# Altium project Preliminary.PrjPcb
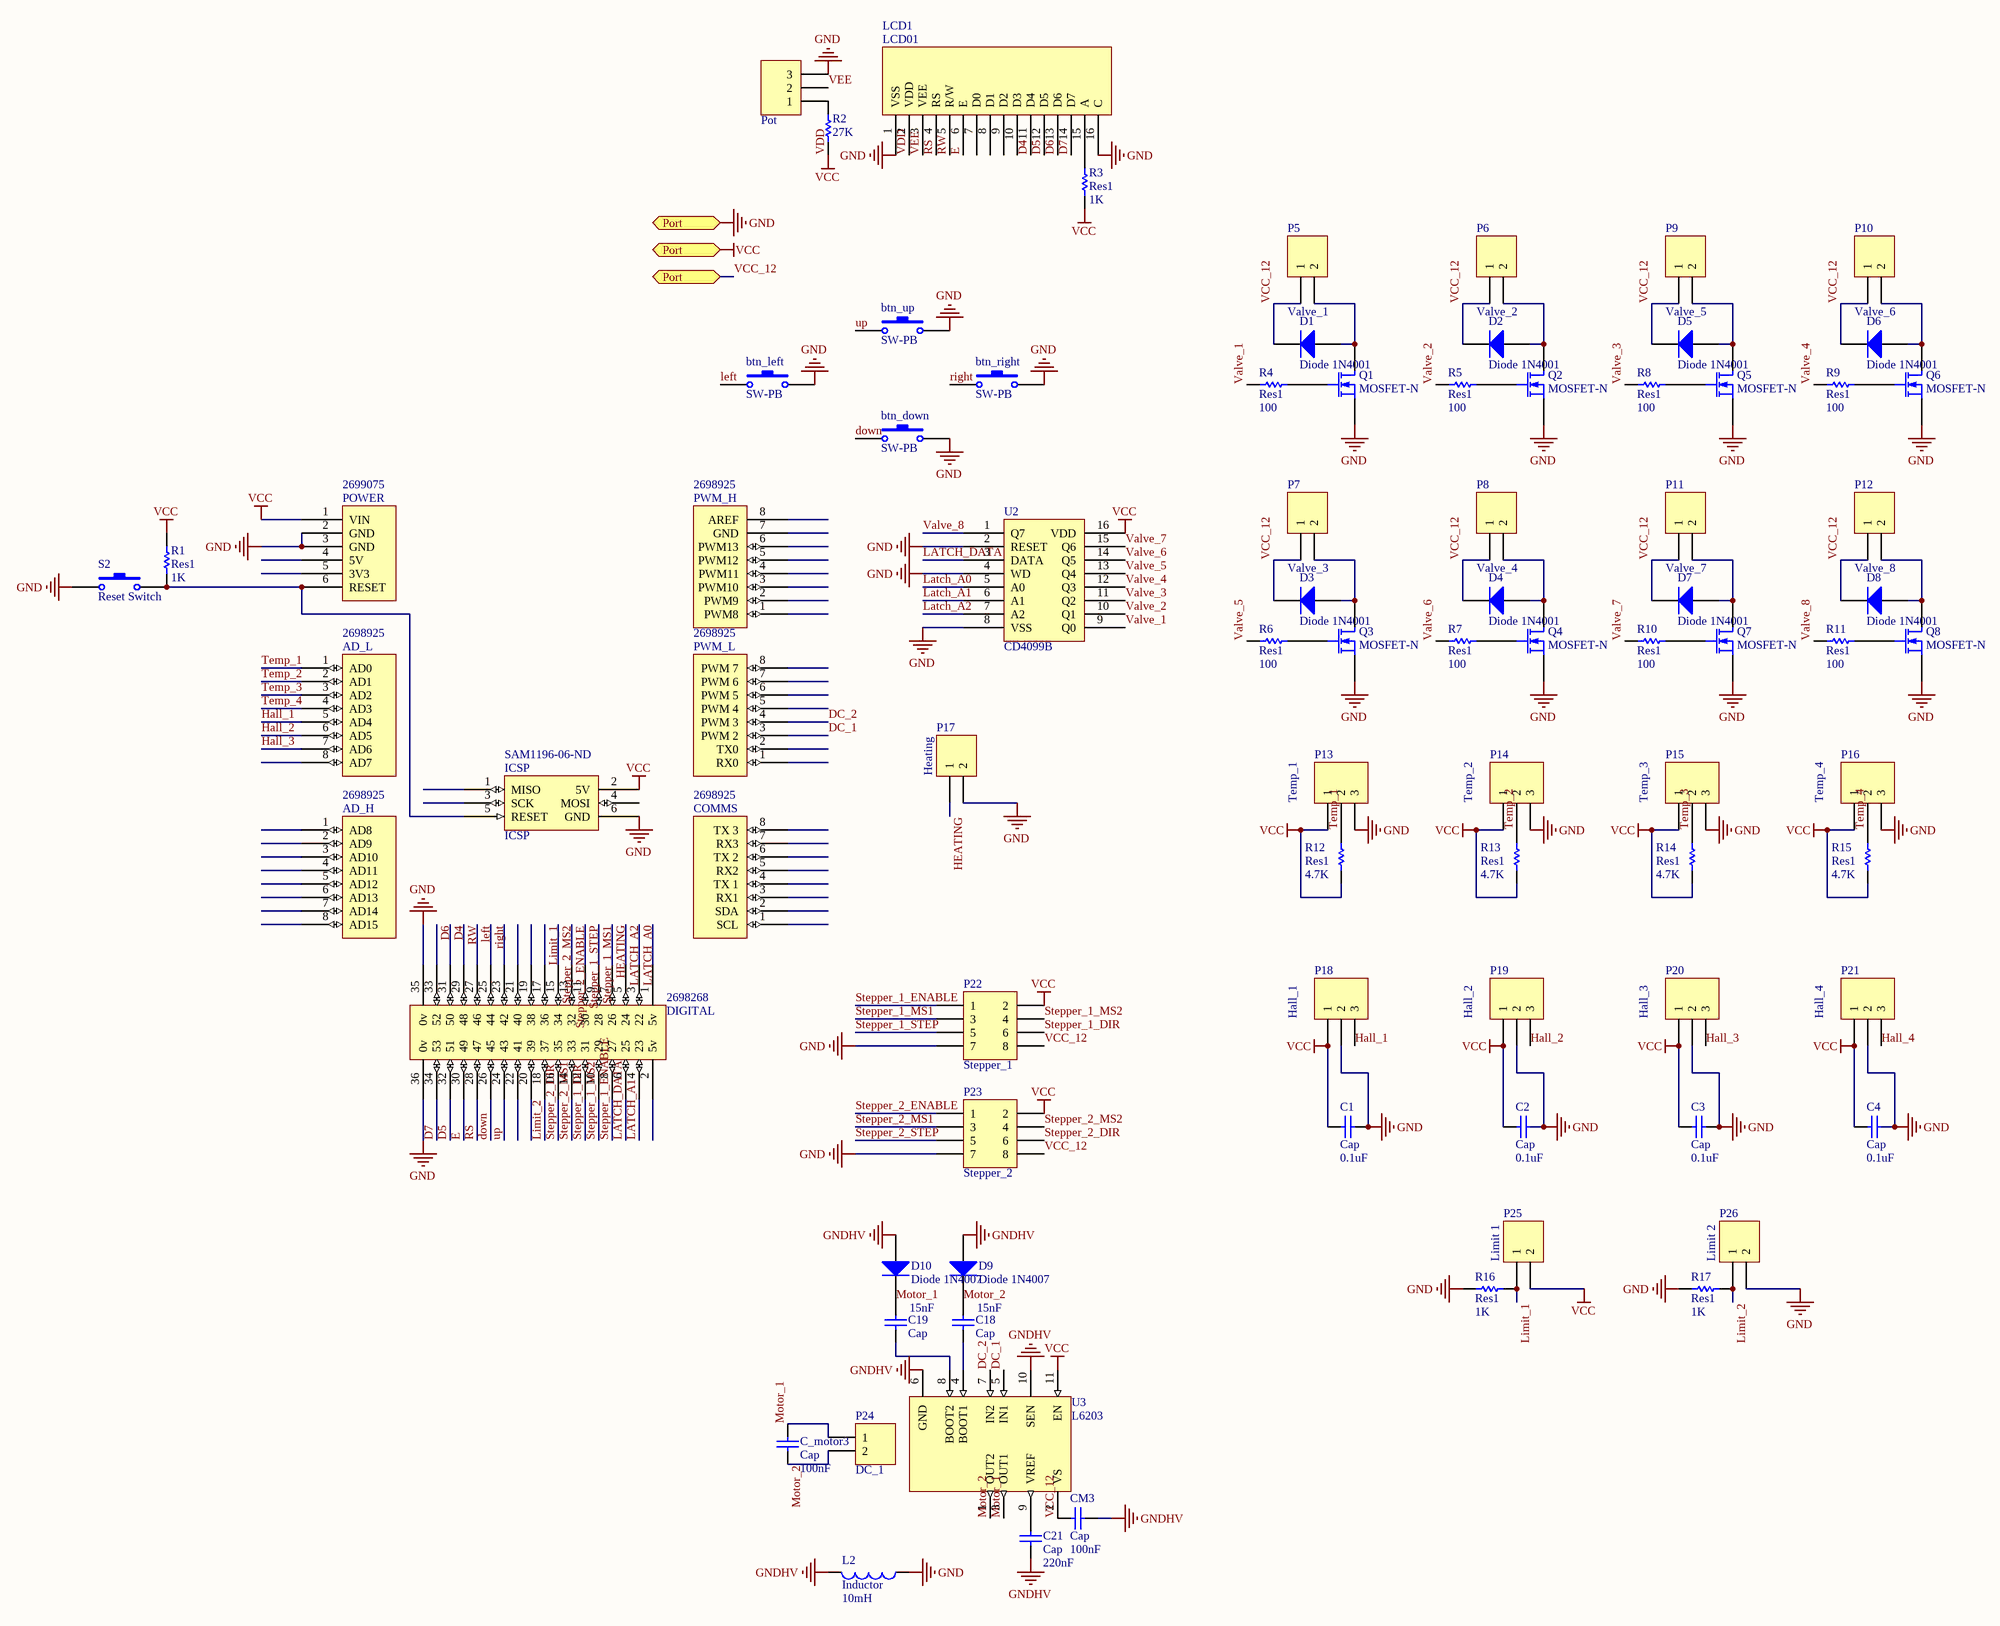
[diagram p0: MainBoard.SchDoc]
2 sheets, 90 parts. Net scope: flat (ports and power ports of the same name join across sheets).
Board file: MainBoard.PcbDoc
Sheets:
  MainBoard.SchDoc
  Heating.SchDoc

## Sheet MainBoard.SchDoc
size 762 x 482 mm

### Parts
AD_H  Supplier Part Number 4: 2698925  [Header 8x1 8.5mm]  (hidden comment: AD_H)
AD_L  Supplier Part Number 5: 2698925  [Header 8x1 8.5mm]  (hidden comment: AD_L)
btn_down  SW-PB  [swblue]
btn_left  SW-PB  [swblue]
btn_right  SW-PB  [swblue]
btn_up  SW-PB  [swblue]
C1  Cap  value 0.1uF  [RAD-0.3]
C2  Cap  value 0.1uF  [RAD-0.3]
C3  Cap  value 0.1uF  [RAD-0.3]
C4  Cap  value 0.1uF  [RAD-0.3]
C18  Cap  value 15nF  [VP32-3.2]
C19  Cap  value 15nF  [VP32-3.2]
C21  Cap  value 220nF  [c224]
C_motor3  Cap  value 100nF  [VP32-3.2]
CM3  Cap  value 100nF  [VP32-3.2]
COMMS  Supplier Part Number 4: 2698925  [Header 8x1 8.5mm]  (hidden comment: Communication)
D1  Diode 1N4001  [DO-41]
D2  Diode 1N4001  [DO-41]
D3  Diode 1N4001  [DO-41]
D4  Diode 1N4001  [DO-41]
D5  Diode 1N4001  [DO-41]
D6  Diode 1N4001  [DO-41]
D7  Diode 1N4001  [DO-41]
D8  Diode 1N4001  [DO-41]
D9  Diode 1N4007  [DO-41]
D10  Diode 1N4007  [DO-41]
DIGITAL  Supplier Part Number 5: 2698268  [HEADER 36X 8MM]  (hidden comment: IO_36)
ICSP  ICSP  Supplier Part Number 5: SAM1196-06-ND  [ICSP]
L2  Inductor  value 10mH  [0402-A]
LCD1  lcd  [lcd_woborder]  (value not drawn)
P5  Valve_1  [HDR1X2]
P6  Valve_2  [HDR1X2]
P7  Valve_3  [HDR1X2]
P8  Valve_4  [HDR1X2]
P9  Valve_5  [HDR1X2]
P10  Valve_6  [HDR1X2]
P11  Valve_7  [HDR1X2]
P12  Valve_8  [HDR1X2]
P13  Temp_1  [HDR1X3]
P14  Temp_2  [HDR1X3]
P15  Temp_3  [HDR1X3]
P16  Temp_4  [HDR1X3]
P17  Heating  [HDR1X2]
P18  Hall_1  [HDR1X3]
P19  Hall_2  [HDR1X3]
P20  Hall_3  [HDR1X3]
P21  Hall_4  [HDR1X3]
P22  Stepper_1  [HDR2X4]
P23  Stepper_2  [HDR2X4]
P24  DC_1  [1X2]
P25  Limit 1  [HDR1X2]
P26  Limit 2  [HDR1X2]
Pot  Pot  [HDR1X3]
POWER  Supplier Part Number 2: 2699075  [Header 6x1 8.5mm]  (hidden comment: POWER)
PWM_H  Supplier Part Number 4: 2698925  [Header 8x1 8.5mm]  (hidden comment: PWM_H)
PWM_L  Supplier Part Number 4: 2698925  [Header 8x1 8.5mm]  (hidden comment: PWM_L)
Q1  MOSFET-N  [E3]
Q2  MOSFET-N  [E3]
Q3  MOSFET-N  [E3]
Q4  MOSFET-N  [E3]
Q5  MOSFET-N  [E3]
Q6  MOSFET-N  [E3]
Q7  MOSFET-N  [E3]
Q8  MOSFET-N  [E3]
R1  Res1  value 1K  [AXIAL-0.3]
R2  value 27K  [AXIAL-0.3]  (hidden comment: Res1)
R3  Res1  value 1K  [AXIAL-0.3]
R4  Res1  value 100  [AXIAL-0.3]
R5  Res1  value 100  [AXIAL-0.3]
R6  Res1  value 100  [AXIAL-0.3]
R7  Res1  value 100  [AXIAL-0.3]
R8  Res1  value 100  [AXIAL-0.3]
R9  Res1  value 100  [AXIAL-0.3]
R10  Res1  value 100  [AXIAL-0.3]
R11  Res1  value 100  [AXIAL-0.3]
R12  Res1  value 4.7K  [AXIAL-0.3]
R13  Res1  value 4.7K  [AXIAL-0.3]
R14  Res1  value 4.7K  [AXIAL-0.3]
R15  Res1  value 4.7K  [AXIAL-0.3]
R16  Res1  value 1K  [AXIAL-0.3]
R17  Res1  value 1K  [AXIAL-0.3]
S2  Reset Switch  [SPST-2]
U2  CD4099B  [CB4099B]
U3  L6203  [DRVCON]

### Ports
Port

### Nets
GNDHV: C21.2 CM3.2 D9.1(A) D10.1(A) L2.2 U3.6(GND) U3.10(SEN)
VCC_12: btn_down.2 btn_left.2 btn_right.2 btn_up.2 C1.1 C1.2 C2.1 C2.2 C3.1 C3.2 C4.1 C4.2 CM3.1 D1.2(K) D2.2(K) D3.2(K) D4.2(K) D5.2(K) D6.2(K) D7.2(K) D8.2(K) DIGITAL.35(0v) DIGITAL.36(0v) ICSP.2(5V) ICSP.6(GND) L2.1 LCD1.1(VSS) LCD1.2(VDD) LCD1.16(C) P5.1 P6.1 P7.1 P8.1 P9.1 P10.1 P11.1 P12.1 P13.1 P13.3 P14.1 P14.3 P15.1 P15.3 P16.1 P16.3 P17.2 P18.1 P18.2 P19.1 P19.2 P20.1 P20.2 P21.1 P21.2 P22.2 P22.7 P22.8 P23.2 P23.7 P23.8 P25.2 P26.2 Pot.3 POWER.1(VIN) POWER.2(GND) POWER.3(GND) Q1.3(S) Q2.3(S) Q3.3(S) Q4.3(S) Q5.3(S) Q6.3(S) Q7.3(S) Q8.3(S) R1.1 R2.2 R3.1 R12.1 R13.1 R14.2 R15.1 R16.2 R17.2 S2.1 U2.2(RESET) U2.4(WD) U2.8(VSS) U2.16(VDD) U3.2(VS) U3.11(EN) ; port Port  [also labelled GND, VCC, VDD]
D4: DIGITAL.31(50) LCD1.11(D4)
D5: DIGITAL.32(51) LCD1.12(D5)
D6: DIGITAL.33(52) LCD1.13(D6)
D7: DIGITAL.34(53) LCD1.14(D7)
DC_1: PWM_L.3(PWM_2) U3.5(IN1)
DC_2: PWM_L.4(PWM_3) U3.7(IN2)
down: btn_down.1 DIGITAL.26(45)
E: DIGITAL.30(49) LCD1.6(E)
Hall_1: AD_L.5(AD4) P18.3
Hall_2: AD_L.6(AD5) P19.3
Hall_3: AD_L.7(AD6) P20.3
Hall_4: P21.3
HEATING: DIGITAL.7(26) P17.1
Latch_A0: DIGITAL.3(22) U2.5(A0)
Latch_A1: DIGITAL.4(23) U2.6(A1)
Latch_A2: DIGITAL.5(24) U2.7(A2)
LATCH_DATA: DIGITAL.6(25) U2.3(DATA)
left: btn_left.1 DIGITAL.27(46)
Limit_1: DIGITAL.17(36) P25.1 R16.1
Limit_2: DIGITAL.18(37) P26.1 R17.1
Motor_1: C19.2 C_motor3.2 D10.2(K) P24.1 U3.3(OUT1)
Motor_2: C18.2 C_motor3.1 D9.2(K) P24.2 U3.1(OUT2)
right: btn_right.1 DIGITAL.25(44)
RS: DIGITAL.28(47) LCD1.4(RS)
RW: DIGITAL.29(48) LCD1.5(R/W)
Stepper_1_DIR: DIGITAL.12(31) P22.6
Stepper_1_ENABLE: DIGITAL.8(27) P22.1
Stepper_1_MS1: DIGITAL.9(28) P22.3
Stepper_1_MS2: DIGITAL.10(29) P22.4
Stepper_1_STEP: DIGITAL.11(30) P22.5
Stepper_2_DIR: DIGITAL.16(35) P23.6
Stepper_2_ENABLE: DIGITAL.13(32) P23.1
Stepper_2_MS1: DIGITAL.14(33) P23.3
Stepper_2_MS2: DIGITAL.15(34) P23.4
Stepper_2_STEP: P23.5
Temp_1: AD_L.1(AD0) P13.2 R12.2
Temp_2: AD_L.2(AD1) P14.2 R13.2
Temp_3: AD_L.3(AD2) P15.2 R14.1
Temp_4: AD_L.4(AD3) P16.2 R15.2
up: btn_up.1 DIGITAL.24(43)
Valve_1: R4.1 U2.9(Q0)
Valve_2: R5.1 U2.10(Q1)
Valve_3: R8.1 U2.11(Q2)
Valve_4: R9.1 U2.12(Q3)
Valve_5: R6.1 U2.13(Q4)
Valve_6: R7.1 U2.14(Q5)
Valve_7: R10.1 U2.15(Q6)
Valve_8: R11.1 U2.1(Q7)
VEE: LCD1.3(VEE) Pot.2
NetC18_1: C18.1 U3.4(BOOT1)
NetC19_1: C19.1 U3.8(BOOT2)
NetC21_1: C21.1 U3.9(VREF)
NetD1_1: D1.1(A) P5.2 Q1.1(D)
NetD2_1: D2.1(A) P6.2 Q2.1(D)
NetD3_1: D3.1(A) P7.2 Q3.1(D)
NetD4_1: D4.1(A) P8.2 Q4.1(D)
NetD5_1: D5.1(A) P9.2 Q5.1(D)
NetD6_1: D6.1(A) P10.2 Q6.1(D)
NetD7_1: D7.1(A) P11.2 Q7.1(D)
NetD8_1: D8.1(A) P12.2 Q8.1(D)
NetICSP_5: ICSP.5(RESET) POWER.6(RESET) R1.2 S2.2
NetLCD1_15: LCD1.15(A) R3.2
NetPot_1: Pot.1 R2.1
NetQ1_2: Q1.2(G) R4.2
NetQ2_2: Q2.2(G) R5.2
NetQ3_2: Q3.2(G) R6.2
NetQ4_2: Q4.2(G) R7.2
NetQ5_2: Q5.2(G) R8.2
NetQ6_2: Q6.2(G) R9.2
NetQ7_2: Q7.2(G) R10.2
NetQ8_2: Q8.2(G) R11.2

Not connected (* = marked no-connect by the designer): AD_H 1(AD8) 2(AD9) 3(AD10) 4(AD11) 5(AD12) 6(AD13) 7(AD14) 8(AD15); AD_L 8(AD7); COMMS 1(SCL) 2(SDA) 3(RX1) 4(TX_1) 5(RX2) 6(TX_2) 7(RX3) 8(TX_3); DIGITAL 1(5v) 2(5v) 19(38) 20(39) 21(40) 22(41) 23(42); ICSP 1(MISO) 3(SCK) 4(MOSI); LCD1 7(D0) 8(D1) 9(D2) 10(D3); POWER 4(5V) 5(3V3); PWM_H 1(PWM8) 2(PWM9) 3(PWM10) 4(PWM11) 5(PWM12) 6(PWM13) 7(GND) 8(AREF); PWM_L 1(RX0) 2(TX0) 5(PWM_4) 6(PWM_5) 7(PWM_6) 8(PWM_7)

### Notes on the sheet
- (in symbol lcd) LCD01

### Library data of the parts
btn_down btn_left btn_right btn_up S2 = SW-PB: Switch; Published: 24-Mar-1999; LatestRevisionDate: 17-Jul-2002; LatestRevisionNote: Re-released for DXP Platform.; PackageReference: SPST-2; Publisher: Altium Limited
C1-C4 C18 C19 C21 C_motor3 CM3 = Cap: Capacitor; Published: 8-Jun-2000; LatestRevisionDate: 17-Jul-2002; LatestRevisionNote: Re-released for DXP Platform.; PackageReference: RAD-0.3; Publisher: Altium Limited
  C1-C4 C_motor3 CM3: PackageDescription: Radial Cap, Thru-Hole; 2 Leads; 0.3 in Pin Spacing
D1-D8 = Diode 1N4001: 1 Amp General Purpose Rectifier; Published: 8-Jun-2000; LatestRevisionDate: 17-Jul-2002; LatestRevisionNote: Re-released for DXP Platform.; DatasheetVersion: 1998; PackageVersion: Aug-1999; PackageReference: DO-41; Publisher: Altium Limited; PackageDescription: Diode, Axial; Body 5.2 x 2.7 mm (LxDia. max), Lead Dia. 0.86 mm (max); Code_JEDEC: DO-204-AL; ComponentLink1Description: Manufacturer Link; ComponentLink1URL: http://www.fairchildsemi.com/; ComponentLink2Description: Datasheet; ComponentLink2URL: http://www.fairchildsemi.com/ds/1N%2F1N4001.pdf
D9 D10 = Diode 1N4007: 1 Amp General Purpose Rectifier; Published: 8-Jun-2000; LatestRevisionDate: 17-Jul-2002; LatestRevisionNote: Re-released for DXP Platform.; DatasheetVersion: 1998; PackageVersion: Aug-1999; PackageReference: DO-41; Publisher: Altium Limited; PackageDescription: Diode, Axial; Body 5.2 x 2.7 mm (LxDia. max), Lead Dia. 0.86 mm (max); Code_JEDEC: DO-204-AL; ComponentLink1Description: Manufacturer Link; ComponentLink1URL: http://www.fairchildsemi.com/; ComponentLink2Description: Datasheet; ComponentLink2URL: http://www.fairchildsemi.com/ds/1N%2F1N4001.pdf
L2 = Inductor: Code_IEC: 1005; Published: 8-Jun-2000; LatestRevisionDate: 29-May-2009; LatestRevisionNote: IPC-7351 Footprint Added.; PackageReference: 0402-A; Publisher: Altium Limited; PackageDescription: Chip Inductor; Code_JEITA: 0402
P5-P12 P17 P24-P26 = Header 2: Header, 2-Pin; LatestRevisionDate: 17-Jul-2002; LatestRevisionNote: Re-released for DXP Platform.; Publisher: Altium Limited
P13-P16 P18-P21 Pot = Header 3: Header, 3-Pin; LatestRevisionDate: 17-Jul-2002; LatestRevisionNote: Re-released for DXP Platform.; Publisher: Altium Limited
P22 P23 = Header 4X2: Header, 4-Pin, Dual row; LatestRevisionDate: 17-Jul-2002; LatestRevisionNote: Re-released for DXP Platform.; Publisher: Altium Limited
Q1-Q8 = MOSFET-N: N-Channel MOSFET; Published: 8-Jun-2000; LatestRevisionDate: 17-Jul-2002; LatestRevisionNote: Re-released for DXP Platform.; PackageVersion: 1995/1996; PackageReference: E3; Publisher: Altium Limited; PackageDescription: TO, Flat Index; 3 In-Line, Axial Leads; Body Dia. 4.6mm; Lead Dia. 0.5 mm (max)
R1-R17 = Res1: Resistor; Published: 8-Jun-2000; LatestRevisionDate: 17-Jul-2002; LatestRevisionNote: Re-released for DXP Platform.; PackageReference: AXIAL-0.3; Publisher: Altium Limited
  R4-R17: PackageDescription: Axial Device, Thru-Hole; 2 Leads; 0.3 in Pin Spacing
U3 = L6203: DMOS Full Bridge Driver; Note: TAB connected to pin 6; Published: 8-Jun-2000; LatestRevisionDate: 17-Jul-2002; LatestRevisionNote: Re-released for DXP Platform.; DatasheetVersion: Jul-1997; PackageReference: Multiwatt11; Publisher: Altium Limited; PackageDescription: TO, Thru-Hole, Vertical, Heatsink Mounted; 11 Bent Staggered Leads; Pitch 1.7 mm; ComponentLink1Description: Manufacturer Link; ComponentLink1URL: http://www.st.com/; ComponentLink2Description: Datasheet; ComponentLink2URL: http://www.st.com/stonline/products/literature/ds/1373/l6201.pdf
AD_H = AD_H: Supplier 1: Arrow; Supplier Part Number 1: 2698940; Supplier 2: Arrow; Supplier Part Number 2: 2698939; Supplier 3: Digi-Key; Supplier Part Number 3: SAM1198-08-ND; Supplier 4: Arrow
AD_L = AD_L: Supplier 1: Digi-Key; Supplier Part Number 1: SAM1198-08-ND; Supplier 2: Arrow; Supplier Part Number 2: 2698939; Supplier 3: Arrow; Supplier Part Number 3: 2698940; Supplier 4: Arrow; Supplier Part Number 4: 43085273; Supplier 5: Arrow
COMMS = Communication: Supplier 1: Digi-Key; Supplier Part Number 1: SAM1198-08-ND; Supplier 2: Arrow; Supplier Part Number 2: 2698940; Supplier 3: Arrow; Supplier Part Number 3: 2698939; Supplier 4: Arrow
DIGITAL = IO_36: Supplier 1: Digi-Key; Supplier Part Number 1: SAM1196-18-ND; Supplier 2: Arrow; Supplier Part Number 2: 48117090; Supplier 3: Arrow; Supplier Part Number 3: 46093326; Supplier 4: Arrow; Supplier Part Number 4: 2698278; Supplier 5: Arrow
ICSP = ICSP: Supplier 1: Digi-Key; Supplier Part Number 1: SAM1185-06-ND; Supplier 2: Arrow; Supplier Part Number 2: 2699117; Supplier 3: Arrow; Supplier Part Number 3: 43862781; Supplier 4: Arrow; Supplier Part Number 4: 2699091; Supplier 5: Digi-Key
POWER = POWER: Supplier 1: Arrow; Supplier Part Number 1: 52553843; Supplier 2: Arrow; Supplier 3: Digi-Key; Supplier Part Number 3: SAM1198-06-ND; Supplier 4: Arrow; Supplier Part Number 4: 2699089; Supplier 5: Arrow; Supplier Part Number 5: 2699088
PWM_H = PWM_H: Supplier 1: Digi-Key; Supplier Part Number 1: SAM1198-08-ND; Supplier 2: Arrow; Supplier Part Number 2: 2698940; Supplier 3: Arrow; Supplier Part Number 3: 2698939; Supplier 4: Arrow
PWM_L = PWM_L: Supplier 1: Arrow; Supplier Part Number 1: 2698940; Supplier 2: Arrow; Supplier Part Number 2: 2698939; Supplier 3: Digi-Key; Supplier Part Number 3: SAM1198-08-ND; Supplier 4: Arrow

## Sheet Heating.SchDoc: High Current Heating System
size A; Author: Team WILDCARD; Revision: 1
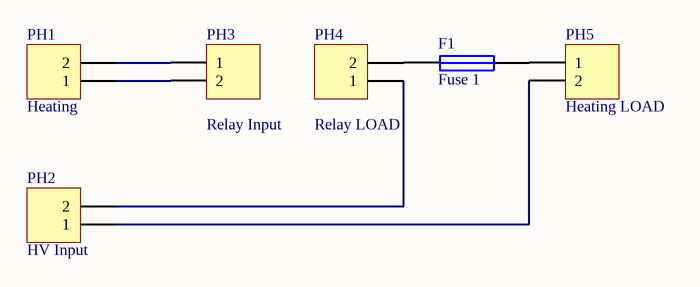
[diagram p1: Heating.SchDoc]

### Parts
F1  Fuse 1  [PIN-W2/E2.8]
PH1  Heating  [HDR1X2]
PH2  HV Input  [HDR1X2]
PH3  Relay Input  [HDR1X2]
PH4  Relay LOAD  [HDR1X2]
PH5  Heating LOAD  [HDR1X2]

### Nets
NetF1_1: F1.1 PH4.2
NetF1_2: F1.2 PH5.1
NetPH1_1: PH1.1 PH3.2
NetPH1_2: PH1.2 PH3.1
NetPH2_1: PH2.1 PH5.2
NetPH2_2: PH2.2 PH4.1

### Library data of the parts
F1 = Fuse 1: Fuse; Published: 8-Jun-2000; LatestRevisionDate: 17-Jul-2002; LatestRevisionNote: Re-released for DXP Platform.; PackageReference: PIN-W2/E2.8; Publisher: Altium Limited; PackageDescription: Thru-Hole; 2 Leads
PH1-PH5 = Header 2: Header, 2-Pin; LatestRevisionDate: 17-Jul-2002; LatestRevisionNote: Re-released for DXP Platform.; Publisher: Altium Limited